# EAGLE schematic Rover-5_Power_Supply (EAGLE 7.7.0)
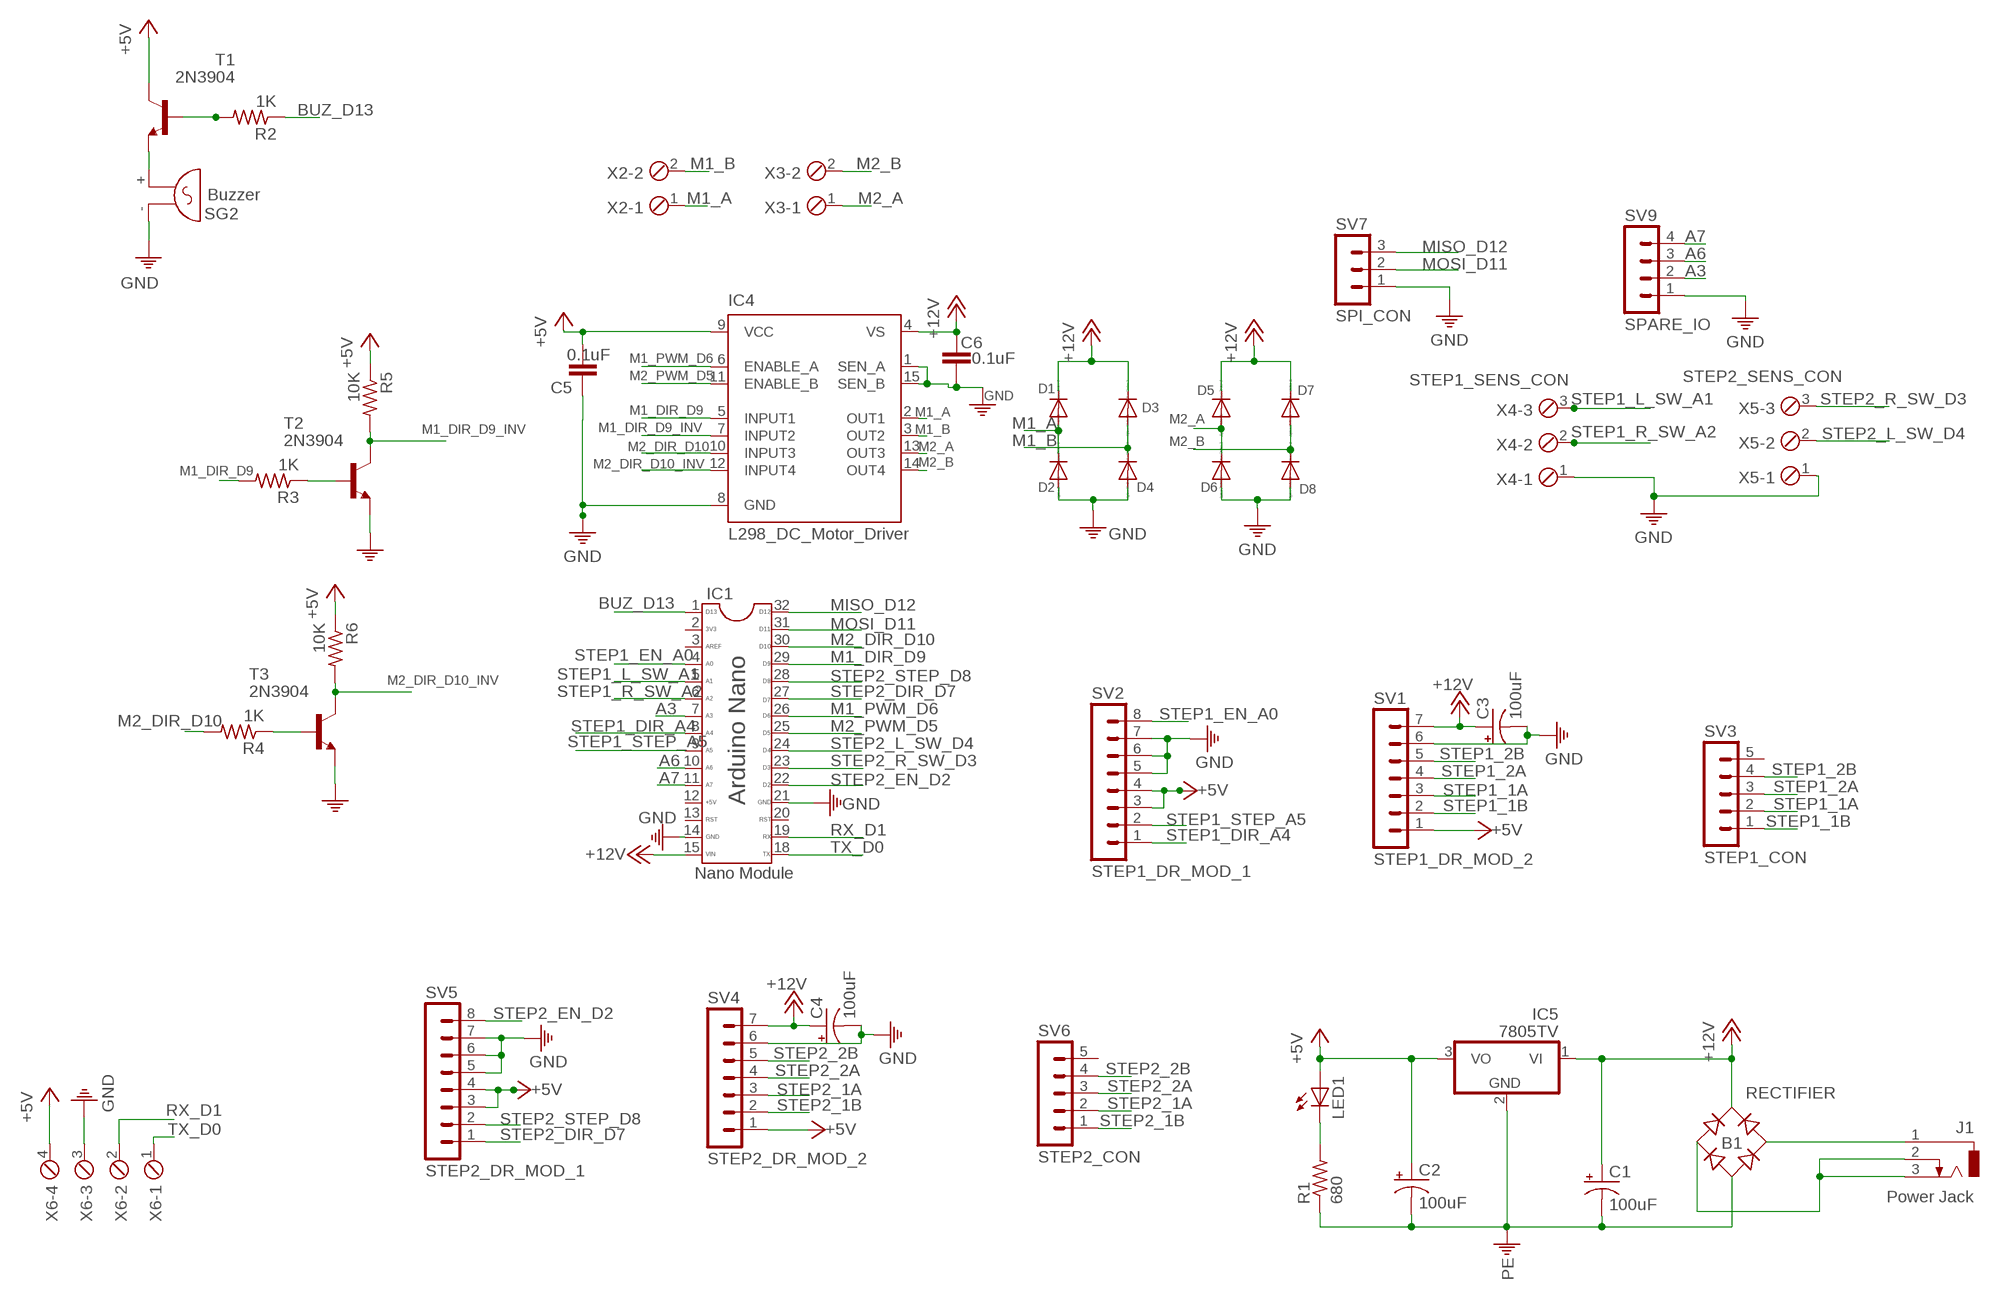
[diagram p0: schematic, sheet 1]

## Parts
B1  RECTIFIER  RB1A  [RB1A]
C1  100uF  CPOL-USE1.8-4  [E1,8-4]
C2  100uF  CPOL-USE1.8-4  [E1,8-4]
C3  100uF  CPOL-USE1.8-4  [E1,8-4]
C4  100uF  CPOL-USE1.8-4  [E1,8-4]
C5  0.1uF  C-EU025-024X044  [C025-024X044]
C6  0.1uF  C-EU025-024X044  [C025-024X044]
D1  DIODE-D-2.5  [D-2.5]
D2  DIODE-D-2.5  [D-2.5]
D3  DIODE-D-2.5  [D-2.5]
D4  DIODE-D-2.5  [D-2.5]
D5  DIODE-D-2.5  [D-2.5]
D6  DIODE-D-2.5  [D-2.5]
D7  DIODE-D-2.5  [D-2.5]
D8  DIODE-D-2.5  [D-2.5]
IC1  Nano Module  DIL32  [DIL32]
IC4  L298_DC_Motor_Driver  L298  [MULTIWATT-15]
IC5  7805TV  [TO220V]
J1  Power Jack  DCJ0303  [ROVER-PW-JACL]
LED1  LED3MM  [LED3MM]
R1  680  R-US_0204/5  [0204/5]
R2  1K  R-US_0204/5  [0204/5]
R3  1K  R-US_0204/5  [0204/5]
R4  1K  R-US_0204/5  [0204/5]
R5  10K  R-US_0204/5  [0204/5]
R6  10K  R-US_0204/5  [0204/5]
SG2  Buzzer  F/QMX  [F/QMX]
SV1  STEP1_DR_MOD_2  MA07-1  [MA07-1]
SV2  STEP1_DR_MOD_1  MA08-1  [MA08-1]
SV3  STEP1_CON  MA05-1  [MA05-1]
SV4  STEP2_DR_MOD_2  MA07-1  [MA07-1]
SV5  STEP2_DR_MOD_1  MA08-1  [MA08-1]
SV6  STEP2_CON  MA05-1  [MA05-1]
SV7  SPI_CON  MA03-1  [MA03-1]
SV9  SPARE_IO  MA04-1  [MA04-1]
T1  2N3904  [TO92]
T2  2N3904  [TO92]
T3  2N3904  [TO92]
X2  MPT2  [2POL254]
X3  MPT2  [2POL254]
X4  STEP1_SENS_CON  MPT3  [3POL254]
X5  STEP2_SENS_CON  MPT3  [3POL254]
X6  MPT4  [4POL254]

## Nets
+5V: C2.+ C5.2 IC4.9(VCC) IC5.3(VO) LED1.A R5.1 R6.1 SV1.1 SV2.3 SV2.4 SV4.1 SV5.3 SV5.4 T1.1(C) X6.4
+12V: B1.+ C1.+ C3.+ C4.+ C6.2 D1.C D3.C D5.C D7.C IC1.15(VIN) IC4.4(VS) IC5.1(VI) SV1.7 SV4.7
A3: IC1.7(A3/D17) SV9.2
A6: IC1.10(A6) SV9.3
A7: IC1.11(A7) SV9.4
BUZ_D13: IC1.1(D13) R2.1
M1_A: D1.A D2.C IC4.2(OUT1) X2.1
M1_B: D3.A D4.C IC4.3(OUT2) X2.2
M1_DIR_D9: IC1.29(D9/PWM) IC4.5(INPUT1) R3.2
M1_DIR_D9_INV: IC4.7(INPUT2) R5.2 T2.1(C)
M1_PWM_D6: IC1.26(D6/PWM) IC4.6(ENABLE_A)
M2_A: D5.A D6.C IC4.13(OUT3) X3.1
M2_B: D7.A D8.C IC4.14(OUT4) X3.2
M2_DIR_D10: IC1.30(D10/PWM) IC4.10(INPUT3) R4.2
M2_DIR_D10_INV: IC4.12(INPUT4) R6.2 T3.1(C)
M2_PWM_D5: IC1.25(D5/PWM) IC4.11(ENABLE_B)
MISO_D12: IC1.32(D12/MISO) SV7.3
MOSI_D11: IC1.31(D11/MOSI) SV7.2
N$2: B1.AC1 J1.1
N$3: B1.AC2 J1.2 J1.3
N$4: LED1.K(C) R1.2
N$5: R4.1 T3.2(B)
N$6: R3.1 T2.2(B)
N$8: SG2.+ T1.3(E)
N$9: R2.2 T1.2(B)
PE: B1.- C1.- C2.- C3.- C4.- C5.1 C6.1 D2.A D4.A D6.A D8.A IC1.14(GND1) IC1.21(GND2) IC4.1(SEN_A) IC4.8(GND) IC4.15(SEN_B) IC5.2(GND) R1.1 SG2.- SV1.6 SV2.5 SV2.6 SV2.7 SV4.6 SV5.5 SV5.6 SV5.7 SV7.1 SV9.1 T2.3(E) T3.3(E) X4.1 X5.1 X6.3 ; supply symbol labelled GND
RX_D1: IC1.19(RX) X6.2
STEP1_1A: SV1.3 SV3.2
STEP1_1B: SV1.2 SV3.1
STEP1_2A: SV1.4 SV3.3
STEP1_2B: SV1.5 SV3.4
STEP1_DIR_A4: IC1.8(A4/D18/SDA) SV2.1
STEP1_EN_A0: IC1.4(A0/D14) SV2.8
STEP1_L_SW_A1: IC1.5(A1/D15) X4.3
STEP1_R_SW_A2: IC1.6(A2/D16) X4.2
STEP1_STEP_A5: IC1.9(A5/D19/SCL) SV2.2
STEP2_1A: SV4.3 SV6.2
STEP2_1B: SV4.2 SV6.1
STEP2_2A: SV4.4 SV6.3
STEP2_2B: SV4.5 SV6.4
STEP2_DIR_D7: IC1.27(D7) SV5.1
STEP2_EN_D2: IC1.22(D2) SV5.8
STEP2_L_SW_D4: IC1.24(D4) X5.2
STEP2_R_SW_D3: IC1.23(D3) X5.3
STEP2_STEP_D8: IC1.28(D8) SV5.2
TX_D0: IC1.18(TX) X6.1
Unconnected: IC1.2(3V3) IC1.3(AREF) IC1.12(5V) IC1.13(RST1) IC1.20(RST2) SV3.5 SV6.5

## Notes on the sheet
- D13 | D12
- 3V3 | D11
- AREF | D10
- Arduino Nano
- A0 | D9
- A1 | D8
- A2
- D7
- A3 | D6
- A4 | D5
- A5 | D4
- A6 | D3
- A7 | D2
- +5V | GND
- RST | RST
- GND | RX
- VIN | TX

## Library data of the parts
B1 = rectifier:RB1A: RECTIFIER 1 A
C1-C4 = rcl:CPOL-US: POLARIZED CAPACITOR, American symbol
C5 C6 = resistor:C-EU: CAPACITOR, European symbol
D1-D8 = diode:DIODE-: DIODE
IC1 = Nano-II_DIP_30P:DIL32: Dual In Line
IC4 = st-microelectronics:L298: DUAL FULL-BRIDGE DRIVER; MPN: L298N; OC_FARNELL: 1589425; OC_NEWARK: 32M1527
IC5 = linear:78*: Positive VOLTAGE REGULATOR Source: http://cache.national.com/ds/LM/LM78L05.pdf http://www.fairchildsemi.com/ds/LM/LM7805.pdf
J1 = Rover-PW-Jack:DCJ0303: DC POWER JACK Source: DCJ0303.pdf; OC_FARNELL: unknown; OC_NEWARK: unknown
LED1 = led:LED: LED OSRAM: - CHIPLED LG R971, LG N971, LY N971, LG Q971, LY Q971, LO R971, LY R971 LH N974, LH R974 LS Q976, LO Q976, LY Q976 LO Q996 - Hyper CHIPLED LW Q18S LB Q993, LB Q99A, LB R99A - SideLED LS A670, LO A670, LY A670, LG A670, LP A670 LB A673, LV A673, LT A673, LW A673 LH A674 LY A675 LS A676, LA A676, LO A676, LY A676, LW A676 LS A679, LY A679, LG A679 - Hyper Micro SIDELED® LS Y876, LA Y876, LO Y876, LY Y876 LT Y87S - SmartLED LW L88C, LW L88S LB L89C, LB L89S, LG L890 LS L89K, LO L89K, LY L89K LS L896, LA L896, LO L896, LY L896 - TOPLED LS T670, LO T670, LY T670, LG T670, LP T670 LSG T670, LSP T670, LSY T670, LOP T670, LYG T670 LG T671, LOG T671, LSG T671 LB T673, LV T673, LT T673, LW T673 LH T674 LS T676, LA T676, LO T676, LY T676, LB T676, LH T676, LSB T676, LW T676 LB T67C, LV T67C, LT T67C, LS T67K, LO T67K, LY T67K, LW E67C LS E67B, LA E67B, LO E67B, LY E67B, LB E67C, LV E67C, LT E67C LW T67C LS T679, LY T679, LG T679 LS T770, LO T770, LY T770, LG T770, LP T770 LB T773, LV T773, LT T773, LW T773 LH T774 LS E675, LA E675, LY E675, LS T675 LS T776, LA T776, LO T776, LY T776, LB T776 LHGB T686 LT T68C, LB T68C - Hyper Mini TOPLED® LB M676 - Mini TOPLED Santana® LG M470 LS M47K, LO M47K, LY M47K Source: http://www.osram.convergy.de LUXEON: - LUMILED® LXK2-PW12-R00, LXK2-PW12-S00, LXK2-PW14-U00, LXK2-PW14-V00 LXK2-PM12-R00, LXK2-PM12-S00, LXK2-PM14-U00 LXK2-PE12-Q00, LXK2-PE12-R00, LXK2-PE12-S00, LXK2-PE14-T00, LXK2-PE14-U00 LXK2-PB12-K00, LXK2-PB12-L00, LXK2-PB12-M00, LXK2-PB14-N00, LXK2-PB14-P00, LXK2-PB14-Q00 LXK2-PR12-L00, LXK2-PR12-M00, LXK2-PR14-Q00, LXK2-PR14-R00 LXK2-PD12-Q00, LXK2-PD12-R00, LXK2-PD12-S00 LXK2-PH12-R00, LXK2-PH12-S00 LXK2-PL12-P00, LXK2-PL12-Q00, LXK2-PL12-R00 Source: www.luxeon.com KINGBRIGHT: KA-3528ASYC Source: www.kingbright.com
R1-R6 = rcl:R-US_: RESISTOR, American symbol
SG2 = buzzer:F/QMX: BUZZER Source: Buerklin; OC_FARNELL: unknown; OC_NEWARK: unknown
SV1 SV4 = con-lstb:MA07-1: PIN HEADER; OC_FARNELL: unknown; OC_NEWARK: unknown
SV2 SV5 = con-lstb:MA08-1: PIN HEADER; OC_FARNELL: unknown; OC_NEWARK: unknown
SV3 SV6 = con-lstb:MA05-1: PIN HEADER; OC_FARNELL: unknown; OC_NEWARK: unknown
SV7 = con-lstb:MA03-1: PIN HEADER; OC_FARNELL: unknown; OC_NEWARK: unknown
SV9 = con-lstb:MA04-1: PIN HEADER; OC_FARNELL: unknown; OC_NEWARK: unknown
T1-T3 = transistor:2N3904: NPN TRANSISTOR
X2 X3 = con-phoenix-254:MPT2: PHOENIX CONNECTOR; OC_FARNELL: unknown; OC_NEWARK: unknown
X4 X5 = con-phoenix-254:MPT3: PHOENIX CONNECTOR; OC_FARNELL: unknown; OC_NEWARK: unknown
X6 = con-phoenix-254:MPT4: PHOENIX CONNECTOR; OC_FARNELL: unknown; OC_NEWARK: unknown